# Altium schematic sheet SAM4S_MCU_Racer.SchDoc: Wacky2020 AD19 HAT test
size A3; DrawnBy: Group 19; Address1: ECE Department; Address2: University of Canterbury; Address3: Christchurch 8041; Address4: New Zealand; Revision: 1
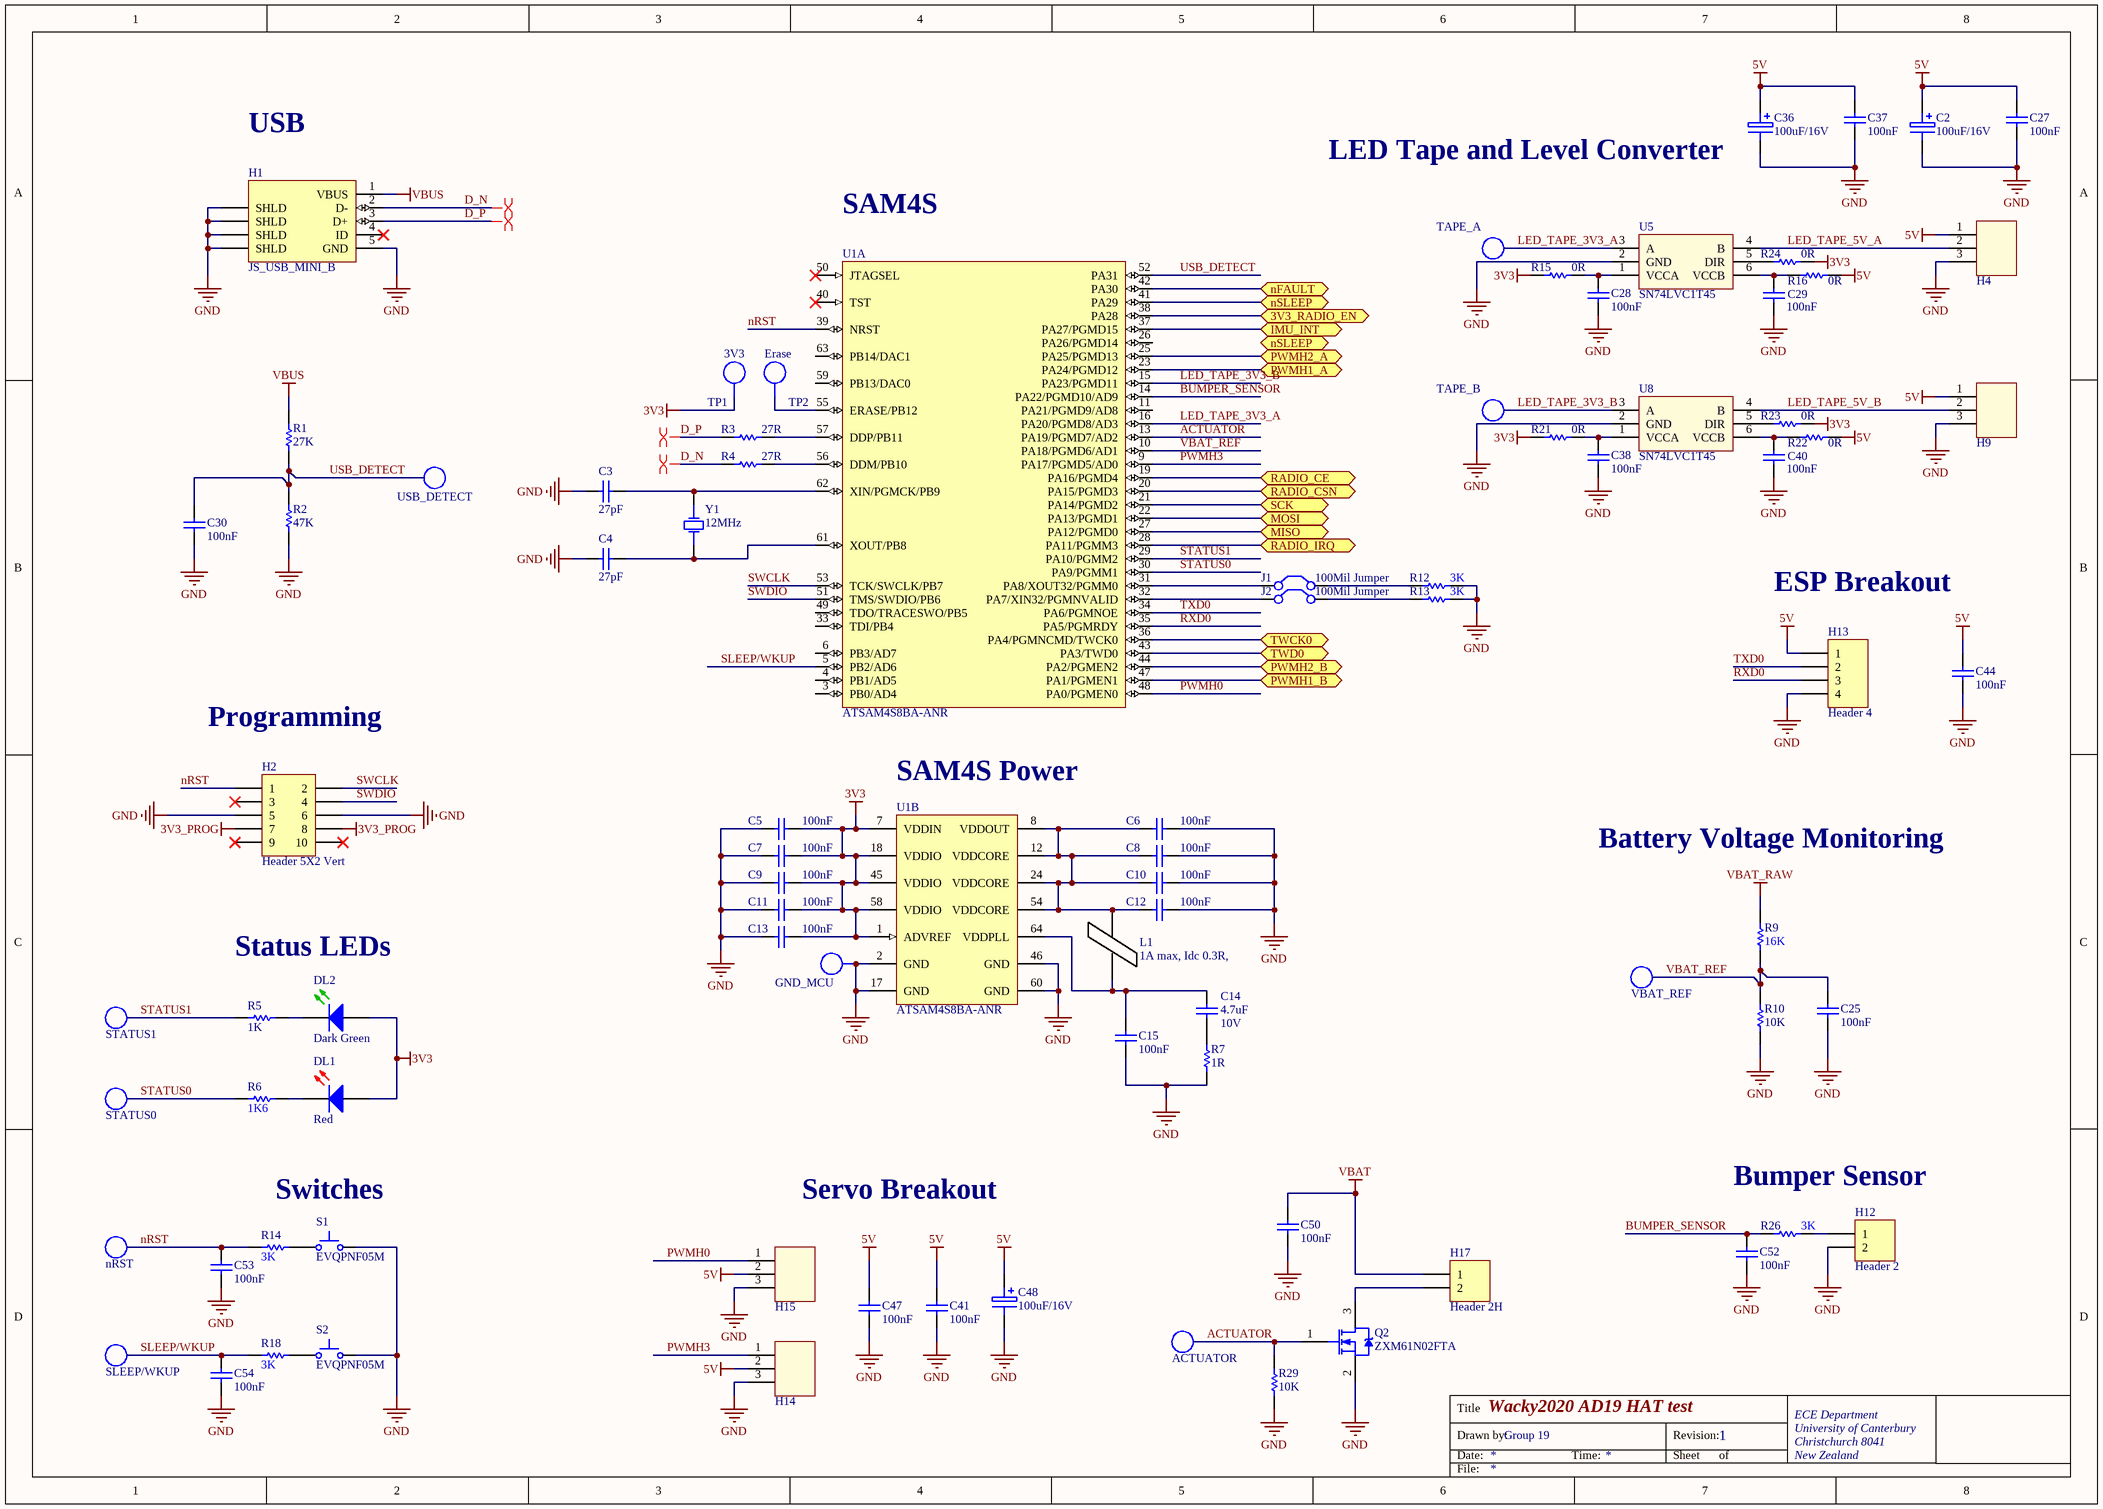
[diagram p0: SAM4S_MCU_Racer.SchDoc]

## Parts
ACTUATOR  TP_0603  [TP_0603]  (value not drawn)
C2  100uF/16V  [NICH-1]
C3  27pF  [CAPC1608L]
C4  27pF  [CAPC1608L]
C5  100nF  [CAPC1608L]
C6  100nF  [CAPC1608L]
C7  100nF  [CAPC1608L]
C8  100nF  [CAPC1608L]
C9  100nF  [CAPC1608L]
C10  100nF  [CAPC1608L]
C11  100nF  [CAPC1608L]
C12  100nF  [CAPC1608L]
C13  100nF  [CAPC1608L]
C14  Max Voltage: 10V  [CAPC1608N]  (hidden comment: 4.7uF)
C15  100nF  [CAPC1608L]
C25  100nF  [CAPC1608L]
C27  100nF  [CAPC1608L]
C28  100nF  [CAPC1608L]
C29  100nF  [CAPC1608L]
C30  100nF  [CAPC1608L]
C36  100uF/16V  [NICH-1]
C37  100nF  [CAPC1608L]
C38  100nF  [CAPC1608L]
C40  100nF  [CAPC1608L]
C41  100nF  [CAPC1608L]
C44  100nF  [CAPC1608L]
C47  100nF  [CAPC1608L]
C48  100uF/16V  [NICH-1]
C50  100nF  [CAPC1608L]
C52  100nF  [CAPC1608L]
C53  100nF  [CAPC1608L]
C54  100nF  [CAPC1608L]
DL1  Red  [WL-SMCW0603]
DL2  Dark Green  [WL-SMCW0603]
GND_MCU  TP  [TP_1206]  (value not drawn)  (no BOM)
H1  JS_USB_MINI_B  [USB/SM0.8-6H5]
H2  Header 5X2 Vert  [IDC2.54-V10D]
H4  HEADER_3  [HEADER_3POS]  (value not drawn)
H9  HEADER_3  [HEADER_3POS]  (value not drawn)
H12  Header 2  [HDR1X2]
H13  Header 4  [HDR1X4]
H14  HEADER_3  [HEADER_3POS]  (value not drawn)
H15  HEADER_3  [HEADER_3POS]  (value not drawn)
H17  Header 2H  [HDR1X2H]
J1  100Mil Jumper  [JMP2.54]
J2  100Mil Jumper  [JMP2.54]
L1  1A max, Idc 0.3R,  [INDC3216L]
nRST  TP_0603  [TP_0603]  (value not drawn)
Q2  ZXM61N02FTA  [SOT23_L]
R1  27K  [RESC1608L]
R2  47K  [RESC1608N]
R3  27R  [RESC1608L]
R4  27R  [RESC1608L]
R5  1K  [RESC1608L]
R6  1K6  [RESC1608L]
R7  1R  [RESC3216L]
R9  16K  [RESC1608L]
R10  10K  [RESC1608L]
R12  3K  [RESC1608L]
R13  3K  [RESC1608L]
R14  3K  [RESC1608L]
R15  0R  [RESC1608L]
R16  0R  [RESC1608L]
R18  3K  [RESC1608L]
R21  0R  [RESC1608L]
R22  0R  [RESC1608L]
R23  0R  [RESC1608L]
R24  0R  [RESC1608L]
R26  3K  [RESC1608L]
R29  10K  [RESC1608L]
S1  EVQPNF05M  [EVQPNF05M]
S2  EVQPNF05M  [EVQPNF05M]
SLEEP/WKUP  TP_0603  [TP_0603]  (value not drawn)
STATUS0  TP_0603  [TP_0603]  (value not drawn)
STATUS1  TP_0603  [TP_0603]  (value not drawn)
TAPE_A  TP_0603  [TP_0603]  (value not drawn)
TAPE_B  TP_0603  [TP_0603]  (value not drawn)
TP1  3V3  [TP_1206]  (no BOM)
TP2  Erase  [TP_1206]  (no BOM)
U1  ATSAM4S8BA-ANR  [LQFP64_L]  (parts A,B of 2)
U5  SN74LVC1T45  [SOT23-6_N]
U8  SN74LVC1T45  [SOT23-6_N]
USB_DETECT  TP_0603  [TP_0603]  (value not drawn)
VBAT_REF  TP_0603  [TP_0603]  (value not drawn)
Y1  12MHz  [6.0X3.5-4]

## Ports
3V3_RADIO_EN (bidir), IMU_INT (bidir), MISO (bidir), MOSI (bidir), nFAULT (bidir), nSLEEP (bidir), PWMH1_A (bidir), PWMH1_B (bidir), PWMH2_A (bidir), PWMH2_B (bidir), RADIO_CE (bidir), RADIO_CSN (bidir), RADIO_IRQ (bidir), SCK (bidir), TWCK0 (bidir), TWD0 (bidir)

## Nets
3V3: C5.2 C7.2 C9.2 C11.2 C13.2 DL1.2(A) DL2.2(A) R15.1 R21.1 R23.2 R24.2 TP1.1 U1.1(ADVREF) U1.7(VDDIN) U1.18(VDDIO) U1.45(VDDIO) U1.58(VDDIO)
3V3_PROG: H2.7 H2.8
5V: C2.2 C27.2 C36.2 C37.2 C41.2 C44.2 C47.2 C48.2 H4.1 H9.1 H13.1 H14.2 H15.2 R16.2 R22.2
GND: C2.1 C3.1 C4.1 C5.1 C6.2 C7.1 C8.2 C9.1 C10.2 C11.1 C12.2 C13.1 C15.2 C25.1 C27.1 C28.1 C29.1 C30.1 C36.1 C37.1 C38.1 C40.1 C41.1 C44.1 C47.1 C48.1 C50.1 C52.1 C53.1 C54.1 GND_MCU.1 H1.5(GND) H1.6(SHLD) H1.7(SHLD) H1.8(SHLD) H1.9(SHLD) H2.5 H2.6 H4.3 H9.3 H12.2 H13.4 H14.3 H15.3 Q2.2 R2.1 R7.1 R10.1 R12.2 R13.2 R29.1 S1.1 S2.1 U1.2(GND) U1.17(GND) U1.46(GND) U1.60(GND) U5.2(GND) U8.2(GND)
VBAT: C50.2 H17.1
VBAT_RAW: R9.2
VBUS: H1.1(VBUS) R1.2
3V3_RADIO_EN: U1.38(PA28) ; port 3V3_RADIO_EN
ACTUATOR: ACTUATOR.1(TP) Q2.1 R29.2 U1.13(PA19/PGMD7/AD2)
BUMPER_SENSOR: C52.2 R26.1 U1.14(PA22/PGMD10/AD9)
D_N: H1.2(D-) R4.1
D_P: H1.3(D+) R3.1
IMU_INT: U1.37(PA27/PGMD15) ; port IMU_INT
LED_TAPE_3V3_A: TAPE_A.1(TP) U1.16(PA20/PGMD8/AD3) U5.3(A)
LED_TAPE_3V3_B: TAPE_B.1(TP) U1.15(PA23/PGMD11) U8.3(A)
LED_TAPE_5V_A: H4.2 U5.4(B)
LED_TAPE_5V_B: H9.2 U8.4(B)
MISO: U1.27(PA12/PGMD0) ; port MISO
MOSI: U1.22(PA13/PGMD1) ; port MOSI
nFAULT: U1.42(PA30) ; port nFAULT
nRST: C53.2 H2.1 nRST.1(TP) R14.1 U1.39(NRST)
nSLEEP: U1.41(PA29) ; port nSLEEP
PWMH0: H15.1 U1.48(PA0/PGMEN0)
PWMH1_A: U1.23(PA24/PGMD12) ; port PWMH1_A
PWMH1_B: U1.47(PA1/PGMEN1) ; port PWMH1_B
PWMH2_A: U1.25(PA25/PGMD13) ; port PWMH2_A
PWMH2_B: U1.44(PA2/PGMEN2) ; port PWMH2_B
PWMH3: H14.1 U1.9(PA17/PGMD5/AD0)
RADIO_CE: U1.19(PA16/PGMD4) ; port RADIO_CE
RADIO_CSN: U1.20(PA15/PGMD3) ; port RADIO_CSN
RADIO_IRQ: U1.28(PA11/PGMM3) ; port RADIO_IRQ
RXD0: H13.3 U1.35(PA5/PGMRDY)
SCK: U1.21(PA14/PGMD2) ; port SCK
SLEEP/WKUP: C54.2 R18.1 SLEEP/WKUP.1(TP) U1.5(PB2/AD6)
STATUS0: R6.1 STATUS0.1(TP) U1.30(PA9/PGMM1)
STATUS1: R5.1 STATUS1.1(TP) U1.29(PA10/PGMM2)
SWCLK: H2.2 U1.53(TCK/SWCLK/PB7)
SWDIO: H2.4 U1.51(TMS/SWDIO/PB6)
TWCK0: U1.36(PA4/PGMNCMD/TWCK0) ; port TWCK0
TWD0: U1.43(PA3/TWD0) ; port TWD0
TXD0: H13.2 U1.34(PA6/PGMNOE)
USB_DETECT: C30.2 R1.1 R2.2 U1.52(PA31) USB_DETECT.1(TP)
VBAT_REF: C25.2 R9.1 R10.2 U1.10(PA18/PGMD6/AD1) VBAT_REF.1(TP)
NetC3_2: C3.2 U1.62(XIN/PGMCK/PB9) Y1.3(OSC2)
NetC4_2: C4.2 U1.61(XOUT/PB8) Y1.1(OSC1)
NetC6_1: C6.1 C8.1 C10.1 C12.1 L1.2 U1.8(VDDOUT) U1.12(VDDCORE) U1.24(VDDCORE) U1.54(VDDCORE)
NetC14_1: C14.1 R7.2
NetC14_2: C14.2 C15.1 L1.1 U1.64(VDDPLL)
NetC28_2: C28.2 R15.2 U5.1(VCCA)
NetC29_2: C29.2 R16.1 U5.6(VCCB)
NetC38_2: C38.2 R21.2 U8.1(VCCA)
NetC40_2: C40.2 R22.1 U8.6(VCCB)
NetDL1_1: DL1.1(K) R6.2
NetDL2_1: DL2.1(K) R5.2
NetH12_1: H12.1 R26.2
NetH17_2: H17.2 Q2.3
NetJ1_1: J1.1(C1) U1.31(PA8/XOUT32/PGMM0)
NetJ1_2: J1.2(C2) R12.1
NetJ2_1: J2.1(C1) U1.32(PA7/XIN32/PGMNVALID)
NetJ2_2: J2.2(C2) R13.1
NetR3_2: R3.2 U1.57(DDP/PB11)
NetR4_2: R4.2 U1.56(DDM/PB10)
NetR14_2: R14.2 S1.2
NetR18_2: R18.2 S2.2
NetR23_1: R23.1 U8.5(DIR)
NetR24_1: R24.1 U5.5(DIR)
NetTP2_1: TP2.1 U1.55(ERASE/PB12)

Not connected (* = marked no-connect by the designer): H1 4(ID)*; H2 3* 9* 10*; U1 3(PB0/AD4) 4(PB1/AD5) 6(PB3/AD7) 11(PA21/PGMD9/AD8) 26(PA26/PGMD14) 33(TDI/PB4) 40(TST)* 49(TDO/TRACESWO/PB5) 50(JTAGSEL)* 59(PB13/DAC0) 63(PB14/DAC1)

## Layout directives
differential pair: D_N, D_P

## Notes on the sheet
- USB
- (near C36) LED Tape and Level Converter
- SAM4S
- ESP Breakout
- Programming
- (near U1) SAM4S Power
- Battery Voltage Monitoring
- Status LEDs
- Bumper Sensor
- Switches
- Servo Breakout
- Title
- Drawn by:
- Date:
- Time:
- Revision:
- Sheet
- of
- File:

## Library data of the parts
ACTUATOR nRST SLEEP/WKUP STATUS0 STATUS1 TAPE_A TAPE_B USB_DETECT VBAT_REF = TP_0603: Test Point 1.65X0.9X1.2mm SMD; Manufacturer: TE Connectivity AMP Connectors; Manufacturer Part Number: 1625854-3; Supplier 1: Digi-Key; Mounting Type: Surface Mount; Terminal: 0.063" x 0.031" x 0.045" (1.60mm x 0.80mm x 1.15mm); Type: PC Test Point; Supplier Part Number 1: A106145CT-ND
C2 C36 C48 = CA_100uF_16V: CAP ALUM 100uF 16V SMD; Manufacturer PN: UWX1C101MCL1GB; Manufacturer: Nichcon; Supplier 1: Farnell; Supplier Part Number 1: 1870677; Storage Location: PCB Assembly WS; Supplier: ECE Dept; Supplier 2: Digi-Key; Supplier Part Number 2: 493-2105-1-ND; Value: 100uF/16V
C3 C4 = CC_27pF_0603: CAP CER 27pF NPO/COG +-5% 50V 0603; PackageReference: 0603; Code_IPC: 1608 [0603]; Verify: *; Supplier: ECE Dept; Storage Location: PCB Assembly WS; Value: 27pF
C5-C13 C15 C25 C27-C30 C37 C38 C40 C41 C44 C47 C50 C52-C54 = CC_100nF_0603: CAP CER 100nF X7R +-10% 50V 0603; PackageReference: 0603; Code_IPC: 1608 [0603]; Verify: *; Supplier: ECE Dept; Storage Location: PCB Assembly WS; Value: 100nF
C14 = CC_4.7uF_0603: CAP CER 4.7uF X5R +-20%  10V 0603; Note: Footprint corresponds to dimensions for bulk cassette packaging. This case size has tightened tolerances.; PackageReference: 0805; Code_IPC: 2012[0805]; Verify: *; Supplier: ECE Dept; Storage Location: PCB Assembly WS; Value: 4.7uF
DL1 = DL_150060RS75000: LED Red 250mcd 0603 SMD; Manufacturer: WURTH ELEKTRONIK; Forward Current If: 30; Forward Voltage: 2; Lens Shape: Rectangular; Luminous Intensity: 250; Wavelength Typ: 625; Viewing Angle: 140°; LED Mounting: SMD; Supplier 1: Farnell; Supplier Part Number 1: 2322071; Manufacturer Part Number: 150060RS75000; Storage Location: PCB Assembly WS; Supplier: ECE Dept; LED Colour: Red
DL2 = DL_150060GS75000: LED Dk Green 430mcd 0603 SMD; Manufacturer: WURTH ELEKTRONIK; Forward Current If: 30; Wavelength Typ: 520; Forward Voltage: 3.2; Lens Shape: Rectangular; Luminous Intensity: 430; Viewing Angle: 140°; LED Mounting: SMD; Supplier 1: Farnell; Supplier Part Number 1: 2322070; Manufacturer Part Number: 150060GS75000; Storage Location: PCB Assembly WS; Supplier: ECE Dept; LED Colour: Dark Green
GND_MCU = TP_1206: Test-Point 3.3x1.6x2.1mm SMD; Manufacturer: Harwin Inc; Manufacturer Part Number: S1751-46R; Manufacturer PN: *; Storage Location: ProtoPlace; Mounting Type: Surface Mount; Type: PC Test Point; Supplier 1: Digi-Key; Supplier Part Number 1: 952-1478-2-ND; Supplier 2: Farnell; Supplier Part Number 2: 1826282; Supplier: ECE Dept; Value: TP
H1 = JS_USB_MINI_B_SMT: USB 2.0, Right Angle, SMT, B Type, Receptacle, 5 Position,; Manufacturer: FCI; Manufacturer PN: 10033526-N3212MLF; Supplier 1: Farnell; Supplier Part Number 1: 1824416; Storage Location: PCB Assembly WS; Supplier: ECE Dept
H2 = JA_HDR_IDC_5X2_VERT: IDC Header, 2,54mm, 10-Pin, Vert; Supplier: ECE Dept; Supplier 1: Farnell; Supplier Part Number 1: 1096985; Storage Location: ECE Dept Store
H4 H9 H14 H15 = HEADER_3: 3Pin Header 2.54mm spacing
H12 = Header 2: Header, 2-Pin; LatestRevisionDate: 17-Jul-2002; LatestRevisionNote: Re-released for DXP Platform.; Publisher: Altium Limited
H13 = Header 4: Header, 4-Pin; LatestRevisionDate: 17-Jul-2002; LatestRevisionNote: Re-released for DXP Platform.; Publisher: Altium Limited
H17 = Header 2H: Header, 2-Pin, Right Angle; LatestRevisionDate: 17-Jul-2002; LatestRevisionNote: Re-released for DXP Platform.; Publisher: Altium Limited
J1 J2 = TP_JUMPER: 2.54mm Jumper Thru Hole; Pitch Spacing: 2.54; No. of Rows: 1; No. of Positions: 2; Supplier: ECE Dept; Supplier 1: Farnell; Supplier Part Number 1: 1097975; Storage Location: ECE$ Store
L1 = IN_Ferrite-Bead: Ferrite Bead, Rdc 0.3R, Z100MHZ 600R, Imax 1A, SMD 1206; Manufacturer: FAIR-RITE; Manufacturer PN: 2512066017Y1; DC Current Rating: 1; DC Resistance Max: 0.08; Ferrite Case Style: 1206 ^3216 Metric]; Frequency Range: 50MHz to 1; Impedance: 600; Impedance Tolerance: ± 25%; Supplier: ECE Dept; Storage Location: PCB Assembly WS; Ferrite Mounting: SMD; Supplier 1: Farnell; Supplier Part Number 1: 1612060; Manufacturer Part Number: 2512066017Y1; Value: 1A max, Idc 0.3R,
Q2 = TM_ZXM61N02FTA: MOSFET N-CH 20V 1.7A SOT23-3; Manufacturer: Diodes Inc; FET Type: MOSFET N-Channel, Metal Oxide; Gate Charge (Qg) @ Vgs: 3.4nC @ 4.5V; Input Capacitance (Ciss) @ Vds: 160pF @ 15V; Power - Max: 625mW; Rds On (Max) @ Id, Vgs: 180 mOhm @ 930mA, 4.5V; Vgs(th) (Max) @ Id: 700mV @ 250µA; Supplier 1: Farnell; Supplier 2: Digi-Key; Current - Continuous Drain (Id) @ 25° C: 1.7A; Drain to Source Voltage (Vdss): 20V; Package / Case: TO-236-3, SC-59, SOT-23-3; Pricing: 1=0.79, 10=0.658, 25=0.5772, 100=0.4939, 250=0.42836, 500=0.36284, 1000=0.27972 (NZD); Supplier Part Number 1: 9525270; Supplier Part Number 2: ZXM61N02FCT-ND; Storage Location: PCB Assembly WS; Supplier: ECE Dept; Manufacturer Part Number: ZXM61N02FTA
R1 = RS_27K: RES 27K OHM 1/10W 5% 0603 SMD; Storage Location: PCB Assembly WS; Supplier: ECE Dept; Value: 27K
R2 = RS_47K: RES 47.0K OHM 1/10W 5% 0603 SMD; Storage Location: PCB Assembly WS; Supplier: ECE Dept; Value: 47K
R3 R4 = RS_27R: RES 27 OHM 1/10W 5% 0603 SMD; Storage Location: PCB Assembly WS; Supplier: ECE Dept; Value: 27R
R5 = RS_1K: RES 1.0K OHM 1/10W 5% 0603 SMD; Storage Location: PCB Assembly WS; Supplier: ECE Dept; Value: 1K
R6 = RS_1K6: RES 1.6K OHM 1/10W 5% 0603 SMD; Storage Location: PCB Assembly WS; Supplier: ECE Dept; Value: 1K6
R7 = RT_1R: RES 1R OHM 1/4W 5% 1206 SMD; Storage Location: PCB Assembly WS; Supplier: ECE Dept; Value: 1R
R9 = RS_16K: RES 16K OHM 1/10W 5% 0603 SMD; Storage Location: PCB Assembly WS; Supplier: ECE Dept; Value: 16K
R10 R29 = RS_10K: RES 10.0K OHM 1/10W 5% 0603 SMD; Storage Location: PCB Assembly WS; Supplier: ECE Dept; Value: 10K
R12-R14 R18 R26 = RS_3K: RES 3K OHM 1/10W 5% 0603 SMD; Storage Location: PCB Assembly WS; Supplier: ECE Dept; Value: 3K
R15 R16 R21-R24 = RS_0R0: RES 0.0 OHM 1/10W 5% 0603 SMD; Storage Location: PCB Assembly WS; Supplier: ECE Dept; Value: 0R
S1 S2 = WS_EVQPNF05M: Panasonic 6 x 3.5mm SMD Light Touch Switch Type SMD; PackageDescription: 6.0 x 3.5 mm; Supplier 1: Farnell; Supplier Part Number 1: 2079481; Manufacturer: Panasonic; Manufacturer PN: EVQPNF05M; Supplier 2: Digi-Key; Supplier Part Number 2: P13598SCT-ND; Storage Location: PCB Assembly WS; Supplier: ECE Dept
TP1 TP2 = TP_1206: Test-Point 3.3x1.6x2.1mm SMD; Manufacturer: Harwin Inc; Manufacturer Part Number: S1751-46R; Value: TP; Manufacturer PN: *; Storage Location: ProtoPlace; Mounting Type: Surface Mount; Type: PC Test Point; Supplier 1: Digi-Key; Supplier Part Number 1: 952-1478-2-ND; Supplier 2: Farnell; Supplier Part Number 2: 1826282; Supplier: ECE Dept
U1 = SE_ATSAM4S16BA-MU: IC MCU 32BIT 512KB FLASH 64LQFP; Manufacturer: Atmel; Connectivity: I²C, IrDA, Memory Card, SPI, SSC, UART/USART, USB; Core Processor: ARM® Cortex®-M4; Core Size: 32-Bit; Data Converters: A/D 11x12b, D/A 2x12b; Number of I/O: 47; Peripherals: Brown-out Detect/Reset, DMA, POR, PWM, WDT; Program Memory Size: 512KB (512K x 8); RAM Size: 128K x 8; Speed: 120MHz; Voltage - Supply (Vcc/Vdd): 1.62 V ~ 3.6 V; PackageVersion: revJ, Jul-2007; PackageReference: 64PS; PackageDescription: 64-Pin Quad Flat No-Lead (QFN) Sawn, 9 x 9 x 1.0 mm Body, 0.5 mm Pitch, Exposed Pad; Code_JEDEC: MO-220VMMD-3; ComponentLink1Description: Manufacturer URL; ComponentLink1URL: http://www.atmel.com/; ComponentLink2Description: SAM4S Series Datasheet; ComponentLink2URL: http://www.atmel.com/dyn/resources/prod_documents/11100.pdf; ComponentLink3Description: SAM4S Series Summary; ComponentLink3URL: http://www.atmel.com/dyn/resources/prod_documents/11100S.pdf; Supplier 1: Digi-Key; Package / Case: 64-LQFP; Packaging: Cut Tape (CT); Program Memory Type: FLASH; Supplier Part Number 1: ATSAM4S8BA-ANRCT-ND; Manufacturer Part Number: ATSAM4S8BA-ANR
U5 U8 = SN74LVC1T45: 1.8V - 5V level converter
Y1 = XT_CRYSTAL_12MHz_18pF: CRYSTAL 12MHZ 18PF 6X3.5mm SMD; Manufacturer: CTS-Frequency Controls; Manufacturer Part Number: 406C35D12M00000; ESR (Equivalent Series Resistance): 60 Ohm; Frequency Stability: ±50ppm; Frequency Tolerance: ±30ppm; Operating Mode: Fundamental; Supplier 1: Digi-Key; Height: 0.047" (1.20mm); Load Capacitance: 18pF; Mounting Type: Surface Mount; Operating Temperature: -20°C ~ 70°C; Package / Case: 4-SMD, No Lead (DFN, LCC); Size / Dimension: 0.236" L x 0.138" W (6.00mm x 3.50mm); Supplier Part Number 1: CTX855CT-ND; Frequency: 12MHz